# EAGLE schematic CONTROL (EAGLE 7.1.0)
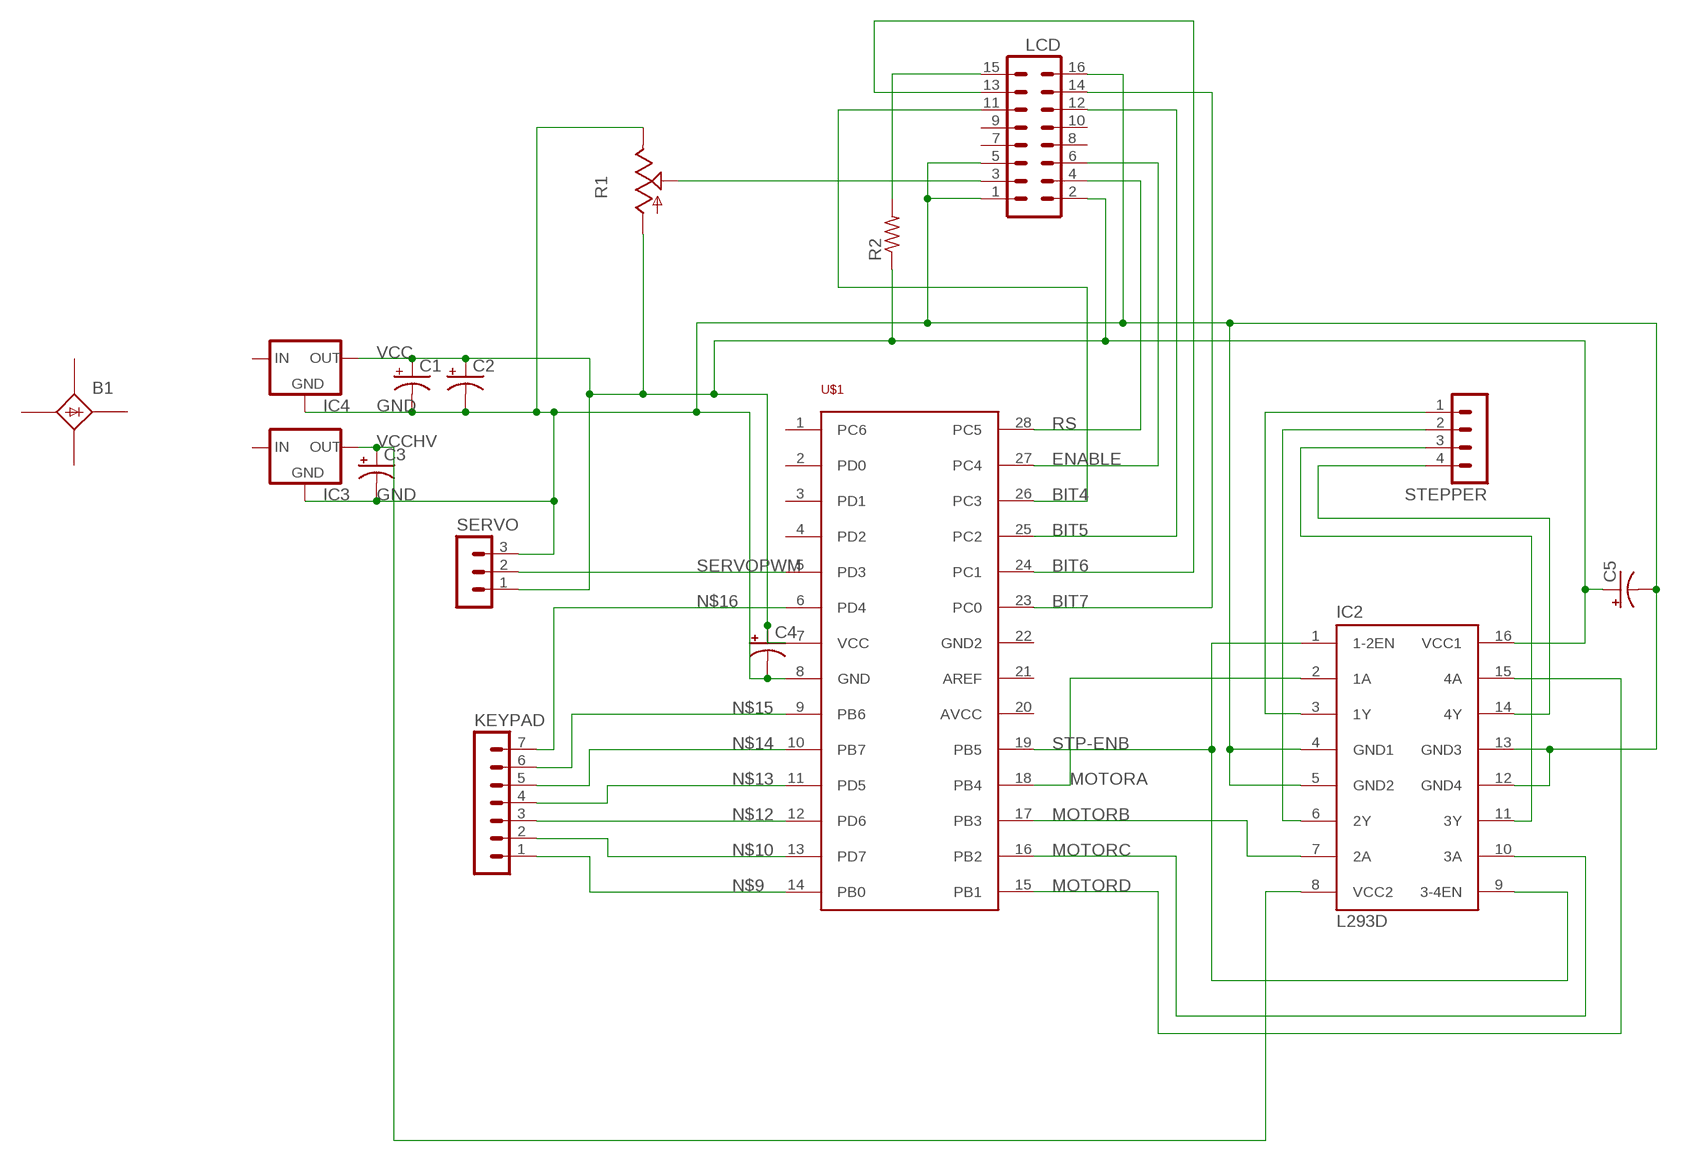
[diagram p0: schematic, sheet 1]

## Parts
B1  B25A-  [B25A-]
C1  CPOL-USE5-8.5  [E5-8,5]
C2  CPOL-USE5-8.5  [E5-8,5]
C3  CPOL-USE5-8.5  [E5-8,5]
C4  CPOL-USE5-8.5  [E5-8,5]
C5  CPOL-USE5-8.5  [E5-8,5]
IC2  L293D  [DIL16]
IC3  78XXS  [78XXS]
IC4  78XXS  [78XXS]
KEYPAD  MA07-1  [MA07-1]
LCD  MA08-2  [MA08-2]
R1  TRIM_US-B25U  [B25U]
R2  R-US_0207/10  [0207/10]
SERVO  MA03-1  [MA03-1]
STEPPER  MA04-1  [MA04-1]
U$1  TDS  [28DIP]

## Nets
BIT4: LCD.11 U$1.26(PC3)
BIT5: LCD.12 U$1.25(PC2)
BIT6: LCD.13 U$1.24(PC1)
BIT7: LCD.14 U$1.23(PC0)
ENABLE: LCD.6 U$1.27(PC4)
GND: C1.- C2.- C3.- C4.- C5.- IC2.4(GND1) IC2.5(GND2) IC2.12(GND4) IC2.13(GND3) IC3.GND IC4.GND LCD.1 LCD.5 LCD.16 R1.E SERVO.3 U$1.8(GND)
MOTORA: IC2.2(1A) U$1.18(PB4)
MOTORB: IC2.7(2A) U$1.17(PB3)
MOTORC: IC2.10(3A) U$1.16(PB2)
MOTORD: IC2.15(4A) U$1.15(PB1)
N$1: LCD.15 R2.2
N$9: KEYPAD.1 U$1.14(PB0)
N$10: KEYPAD.2 U$1.13(PD7)
N$12: KEYPAD.3 U$1.12(PD6)
N$13: KEYPAD.4 U$1.11(PD5)
N$14: KEYPAD.5 U$1.10(PB7)
N$15: KEYPAD.6 U$1.9(PB6)
N$16: KEYPAD.7 U$1.6(PD4)
N$20: IC2.3(1Y) STEPPER.1
N$21: IC2.6(2Y) STEPPER.2
N$22: IC2.11(3Y) STEPPER.3
N$23: IC2.14(4Y) STEPPER.4
RS: LCD.4 U$1.28(PC5)
SERVOPWM: SERVO.2 U$1.5(PD3)
STP-ENB: IC2.1(1-2EN) IC2.9(3-4EN) U$1.19(PB5)
VCC: C1.+ C2.+ C4.+ C5.+ IC2.16(VCC1) IC4.OUT LCD.2 R1.A R2.1 SERVO.1 U$1.7(VCC)
VCCHV: C3.+ IC2.8(VCC2) IC3.OUT
VO: LCD.3 R1.S
Unconnected: B1.+ B1.+1(+) B1.- B1.-1(-) B1.AC1 B1.AC1-(AC1) B1.AC2 B1.AC2-(AC2) IC3.IN IC4.IN LCD.7 LCD.8 LCD.9 LCD.10 U$1.1(PC6) U$1.2(PD0) U$1.3(PD1) U$1.4(PD2) U$1.20(AVCC) U$1.21(AREF) U$1.22(GND2)

## Library data of the parts
B1 = rectifier:B25A-: RECTIFIER 25-A bridge
C1-C5 = rcl:CPOL-US: POLARIZED CAPACITOR, American symbol
IC2 = st-microelectronics:L293D: PUSH-PULL 4 CHANNEL DRIVER; MPN: L293D; OC_FARNELL: 9589619; OC_NEWARK: 56P8249
IC3 IC4 = v-reg:78XXS: VOLTAGE REGULATOR
KEYPAD = con-lstb:MA07-1: PIN HEADER; OC_FARNELL: unknown; OC_NEWARK: unknown
LCD = con-lstb:MA08-2: PIN HEADER; OC_FARNELL: unknown; OC_NEWARK: unknown
R1 = pot:TRIM_US-: POTENTIOMETER
R2 = resistor:R-US_: RESISTOR, American symbol
SERVO = con-lstb:MA03-1: PIN HEADER; OC_FARNELL: unknown; OC_NEWARK: unknown
STEPPER = con-lstb:MA04-1: PIN HEADER; OC_FARNELL: unknown; OC_NEWARK: unknown
U$1 = Atmel:TDS